# Altium project PCB Version 0.3.PrjPcb (part 1 of 2)
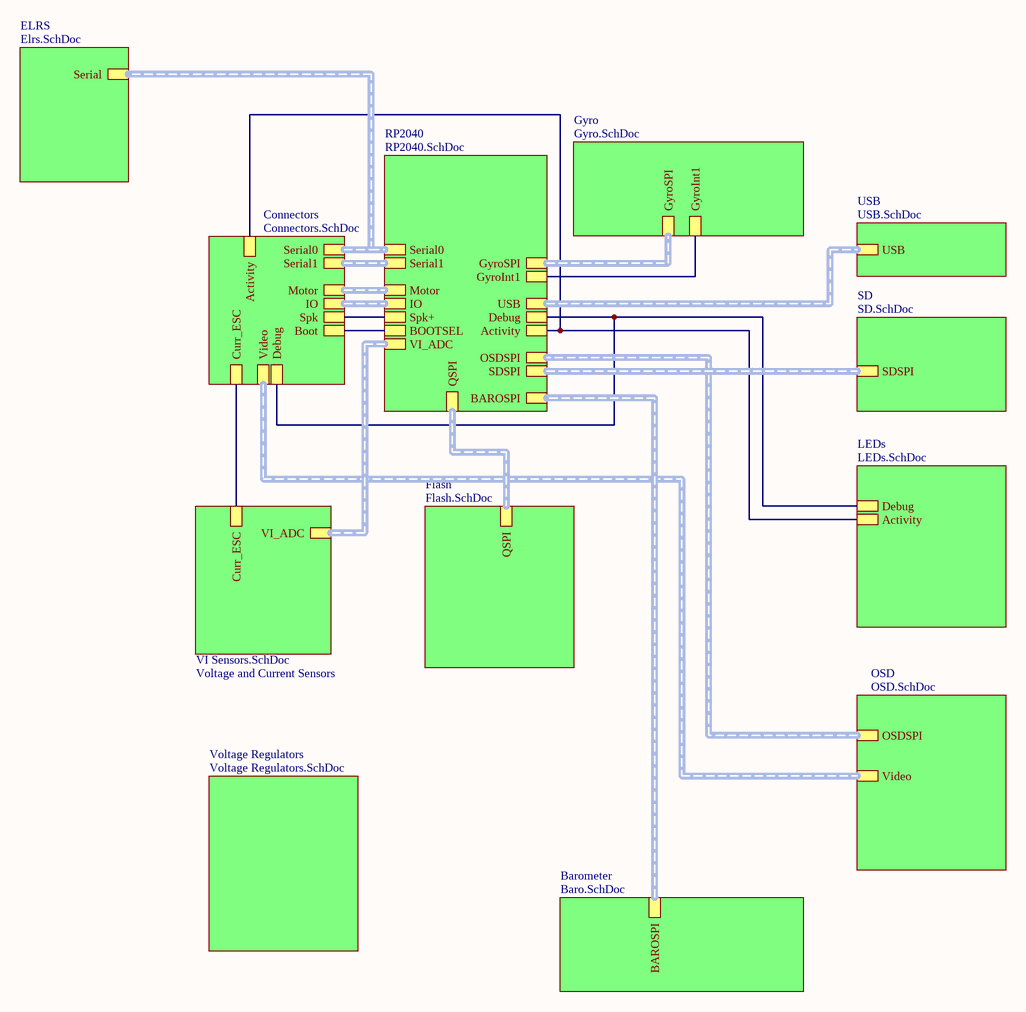
[diagram p0: Main.SchDoc]
12 sheets, 174 parts. Net scope: hierarchical (ports join the sheet entries above them; power ports are global).
Board file: PCB v0.3.PcbDoc
Sheets:
  Main.SchDoc
    RP2040 = RP2040.SchDoc
    Flash = Flash.SchDoc
    Voltage Regulators = Voltage Regulators.SchDoc
    USB = USB.SchDoc
    LEDs = LEDs.SchDoc
    OSD = OSD.SchDoc
    Barometer = Baro.SchDoc
    Gyro = Gyro.SchDoc
    Connectors = Connectors.SchDoc
    Voltage and Current Sensors = VI Sensors.SchDoc
    ELRS = ELRS.SchDoc

## Sheet Main.SchDoc
size A3; SheetNumber: 1; SheetTotal: 13

### Sub-sheets
Barometer = Baro.SchDoc: BAROSPI (harness SPI)
Connectors = Connectors.SchDoc: Serial1 (harness UART), Motor (harness Motor), Serial0 (harness UART), Curr_ESC, IO (harness IO), Video (harness Video), Spk, Debug, Activity, Boot
ELRS = Elrs.SchDoc: Serial (harness UART)
Flash = Flash.SchDoc: QSPI (harness QSPI)
Gyro = Gyro.SchDoc: GyroSPI (harness SPI), GyroInt1
LEDs = LEDs.SchDoc: Debug, Activity
OSD = OSD.SchDoc: OSDSPI (harness SPI), Video (harness Video)
RP2040 = RP2040.SchDoc: QSPI (harness QSPI), USB (harness USB), Debug, Activity, BAROSPI (harness SPI), OSDSPI (harness SPI), GyroSPI (harness SPI), GyroInt1, Serial1 (harness UART), Motor (harness Motor), Serial0 (harness UART), VI_ADC (harness VI), IO (harness IO), Spk+, BOOTSEL, SDSPI (harness SPI)
SD = SD.SchDoc (file not in this document): SDSPI (harness SPI)
USB = USB.SchDoc: USB (harness USB)
Voltage and Current Sensors = VI Sensors.SchDoc: Curr_ESC, VI_ADC (harness VI)
Voltage Regulators = Voltage Regulators.SchDoc: no entries

### Nets
Activity: sheet RP2040/Activity, sheet LEDs/Activity, sheet Connectors/Activity
Curr_ESC: sheet Connectors/Curr_ESC, sheet Voltage and Current Sensors/Curr_ESC
Debug: sheet RP2040/Debug, sheet LEDs/Debug, sheet Connectors/Debug
Gyro_Int1: sheet RP2040/GyroInt1, sheet Gyro/GyroInt1
Spk+: sheet RP2040/Spk+, sheet Connectors/Spk
NetIC1_56: sheet RP2040/BOOTSEL, sheet Connectors/Boot

### Buses and harness runs
harness sheet Barometer/BAROSPI = sheet RP2040/BAROSPI
harness sheet Connectors/IO = sheet RP2040/IO
harness sheet Connectors/Motor = sheet RP2040/Motor
harness sheet Connectors/Serial0 = sheet ELRS/Serial = sheet RP2040/Serial0
harness sheet Connectors/Serial1 = sheet RP2040/Serial1
harness sheet Connectors/Video = sheet OSD/Video
harness sheet Flash/QSPI = sheet RP2040/QSPI
harness sheet Gyro/GyroSPI = sheet RP2040/GyroSPI
harness sheet OSD/OSDSPI = sheet RP2040/OSDSPI
harness sheet RP2040/SDSPI = sheet SD/SDSPI
harness sheet RP2040/USB = sheet USB/USB
harness sheet RP2040/VI_ADC = sheet Voltage and Current Sensors/VI_ADC

## Sheet RP2040.SchDoc
size A3; SheetNumber: 9; SheetTotal: 13; SPICEModelCacheJQUAOKPN: <root> / <DocumentId>JQUAOKPN</DocumentId> / <CacheFrame Number="0"> / <Model Name="0402_885012205086_100nf" Kind="CKT"> / <Text>******* / .subckt 0402_885012205086_100nF 1 2 / Rser 1 3 0.07 / Lser 2 4 0.00000000055 / C1 3 4 0.0000001 / Rpar 3 4 1000000000 / .ends 0402_885012205086_100nF</Text> / </Model> / </CacheFrame> / </root>
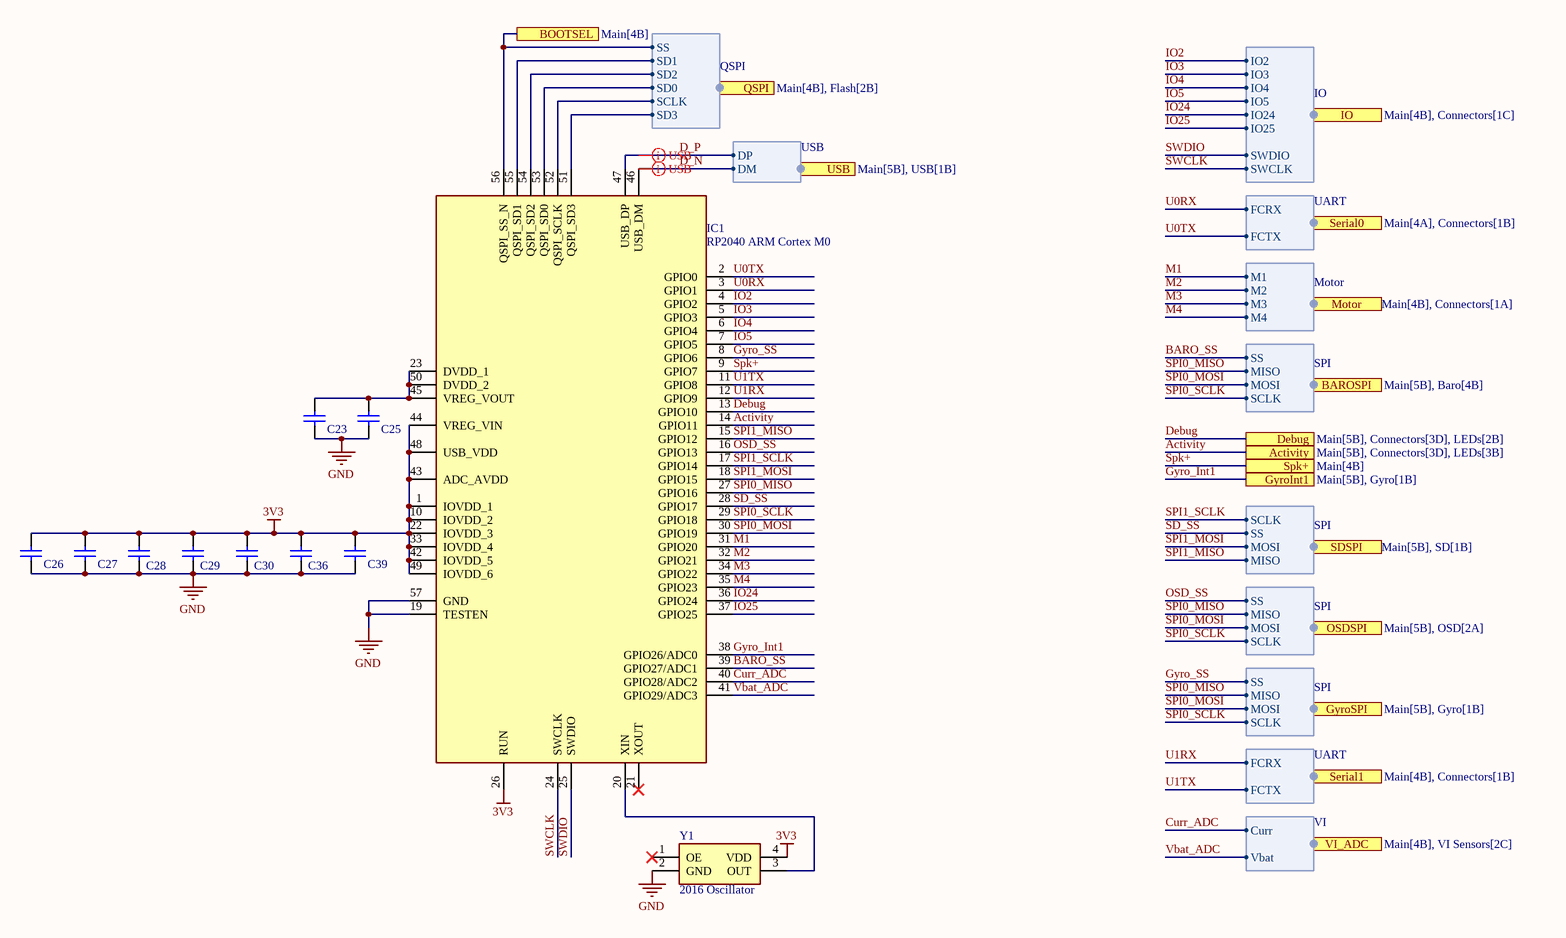
[diagram p1: RP2040.SchDoc]

### Parts
C23  100nF  [WCAP-CSGP_0402_L1W0.5H0.5]  (value not drawn)
C25  100nF  [WCAP-CSGP_0402_L1W0.5H0.5]  (value not drawn)
C26  100nF  [WCAP-CSGP_0402_L1W0.5H0.5]  (value not drawn)
C27  100nF  [WCAP-CSGP_0402_L1W0.5H0.5]  (value not drawn)
C28  100nF  [WCAP-CSGP_0603_L1.6W0.8H0.8_Reflow]  (value not drawn)
C29  100nF  [WCAP-CSGP_0603_L1.6W0.8H0.8_Reflow]  (value not drawn)
C30  100nF  [WCAP-CSGP_0603_L1.6W0.8H0.8_Reflow]  (value not drawn)
C36  100nF  [WCAP-CSGP_0603_L1.6W0.8H0.8_Reflow]  (value not drawn)
C39  100nF  [WCAP-CSGP_0402_L1W0.5H0.5]  (value not drawn)
IC1  RP2040 ARM Cortex M0  [SC091413]
Y1  2016 Oscillator  [2016 Oscillator]

### Ports
Activity (see Main[5B], Connectors[3D], LEDs[3B]), BAROSPI (harness SPI, see Main[5B], Baro[4B]), BOOTSEL (see Main[4B]), Debug (see Main[5B], Connectors[3D], LEDs[2B]), GyroInt1 (see Main[5B], Gyro[1B]), GyroSPI (harness SPI, see Main[5B], Gyro[1B]), IO (harness IO, see Main[4B], Connectors[1C]), Motor (harness Motor, see Main[4B], Connectors[1A]), OSDSPI (harness SPI, see Main[5B], OSD[2A]), QSPI (harness QSPI, see Main[4B], Flash[2B]), SDSPI (harness SPI, see Main[5B], SD[1B]), Serial0 (harness UART, see Main[4A], Connectors[1B]), Serial1 (harness UART, see Main[4B], Connectors[1B]), Spk+ (see Main[4B]), USB (harness USB, see Main[5B], USB[1B]), VI_ADC (harness VI, see Main[4B], VI Sensors[2C])

### Harnesses
QSPI: SS, SD1, SD2, SD0, SCLK, SD3
USB: DP, DM
SPI: SS, MISO, MOSI, SCLK
UART: FCRX, FCTX
Motor: M2, M4, M1, M3
VI: Curr, Vbat
IO: IO24, IO25, SWDIO, SWCLK, IO4, IO5, IO3, IO2
SPI: MISO, MOSI, SS, SCLK

### Nets
3V3: C26.2 C27.2 C28.2 C29.2 C30.2 C36.2 C39.2 IC1.1(IOVDD_1) IC1.10(IOVDD_2) IC1.22(IOVDD_3) IC1.26(RUN) IC1.33(IOVDD_4) IC1.42(IOVDD_5) IC1.43(ADC_AVDD) IC1.44(VREG_VIN) IC1.48(USB_VDD) IC1.49(IOVDD_6) Y1.4(VDD)
GND: C23.1 C25.1 C26.1 C27.1 C28.1 C29.1 C30.1 C36.1 C39.1 IC1.19(TESTEN) IC1.57(GND) Y1.2(GND)
Activity: IC1.14(GPIO11) ; port Activity
BARO_SS: IC1.39(GPIO27/ADC1) ; port BAROSPI.SS
Curr_ADC: IC1.40(GPIO28/ADC2) ; port VI_ADC.Curr
D_N: IC1.46(USB_DM) ; port USB.DM
D_P: IC1.47(USB_DP) ; port USB.DP
Debug: IC1.13(GPIO10) ; port Debug
Gyro_Int1: IC1.38(GPIO26/ADC0) ; port GyroInt1
Gyro_SS: IC1.8(GPIO6) ; port GyroSPI.SS  [project net CSB]
IO2: IC1.4(GPIO2) ; port IO.IO2
IO3: IC1.5(GPIO3) ; port IO.IO3
IO4: IC1.6(GPIO4) ; port IO.IO4
IO5: IC1.7(GPIO5) ; port IO.IO5
IO24: IC1.36(GPIO24) ; port IO.IO24
IO25: IC1.37(GPIO25) ; port IO.IO25
M1: IC1.31(GPIO20) ; port Motor.M1
M2: IC1.32(GPIO21) ; port Motor.M2
M3: IC1.34(GPIO22) ; port Motor.M3
M4: IC1.35(GPIO23) ; port Motor.M4
OSD_SS: IC1.16(GPIO13) ; port OSDSPI.SS
SD_SS: IC1.28(GPIO17) ; port SDSPI.SS
SPI0_MISO: IC1.27(GPIO16) ; port BAROSPI.MISO, port OSDSPI.MISO, port GyroSPI.MISO  [project net MISO]
SPI0_MOSI: IC1.30(GPIO19) ; port BAROSPI.MOSI, port OSDSPI.MOSI, port GyroSPI.MOSI  [project net MOSI]
SPI0_SCLK: IC1.29(GPIO18) ; port BAROSPI.SCLK, port OSDSPI.SCLK, port GyroSPI.SCLK  [project net SCLK]
SPI1_MISO: IC1.15(GPIO12) ; port SDSPI.MISO
SPI1_MOSI: IC1.18(GPIO15) ; port SDSPI.MOSI
SPI1_SCLK: IC1.17(GPIO14) ; port SDSPI.SCLK
Spk+: IC1.9(GPIO7) ; port Spk+
SWCLK: IC1.24(SWCLK) ; port IO.SWCLK
SWDIO: IC1.25(SWDIO) ; port IO.SWDIO
U0RX: IC1.3(GPIO1) ; port Serial0.FCRX  [project net ESPTX]
U0TX: IC1.2(GPIO0) ; port Serial0.FCTX  [project net ESPRX]
U1RX: IC1.12(GPIO9) ; port Serial1.FCRX
U1TX: IC1.11(GPIO8) ; port Serial1.FCTX
Vbat_ADC: IC1.41(GPIO29/ADC3) ; port VI_ADC.Vbat
NetC23_2: C23.2 C25.2 IC1.23(DVDD_1) IC1.45(VREG_VOUT) IC1.50(DVDD_2)
NetIC1_20: IC1.20(XIN) Y1.3(OUT)
NetIC1_51: IC1.51(QSPI_SD3) ; port QSPI.SD3
NetIC1_52: IC1.52(QSPI_SCLK) ; port QSPI.SCLK
NetIC1_53: IC1.53(QSPI_SD0) ; port QSPI.SD0
NetIC1_54: IC1.54(QSPI_SD2) ; port QSPI.SD2
NetIC1_55: IC1.55(QSPI_SD1) ; port QSPI.SD1
NetIC1_56: IC1.56(QSPI_SS_N) ; port BOOTSEL, port QSPI.SS

Not connected (* = marked no-connect by the designer): IC1 21(XOUT)*; Y1 1(OE)*

### Layout directives
differential pair: D_N, D_P

### Library data of the parts
C23 C25-C27 C39 = 885012205086: WCAP-CSGP Multilayer Ceramic Chip Capacitor, General Purpose, size 0402, X7R, 100nF, 50VDC; Manufacturer: Wurth Elektronik; Case/Size Code: 0402; Capacitance Tolerance: +/-10%; Dissipation Factor: 10%; Insulation Resistance: 0.5GΩ; Rated Voltage (DC): 50V; Technical Reference: X7R0402104K050DFCT10000; Manufacturer Part Number: 885012205086; Category: Multilayer Ceramic Chip Capacitors; Match Code: WCAP-CSGP; ComponentLink1Description: Website Link; ComponentLink1URL: https://www.we-online.com/redexpert/article/885012205086?ad; ComponentLink2Description: Datasheet Link; ComponentLink2URL: https://www.we-online.com/redexpert/spec/885012205086?ad; Mount: Surface Mount; Operating Temperature Max: 125°C; Operating Temperature Min: -55°C; Packaging: Tape and Reel; Length: 1mm; Width: 0.5mm; Height: 0.5mm; Capacitance: 100nF; Ceramic Type: X7R
C28-C30 C36 = 885012206095: WCAP-CSGP Multilayer Ceramic Chip Capacitor, General Purpose, size 0603, X7R, 100nF, 50VDC; Manufacturer: Wurth Elektronik; Case/Size Code: 0603; Capacitance Tolerance: +/-10%; Dissipation Factor: 3%; Insulation Resistance: 5GΩ; Rated Voltage (DC): 50V; Technical Reference: X7R0603104K050DFCT10000; Manufacturer Part Number: 885012206095; Category: Multilayer Ceramic Chip Capacitors; Match Code: WCAP-CSGP; ComponentLink1Description: Website Link; ComponentLink1URL: https://www.we-online.com/redexpert/article/885012206095?ad; ComponentLink2Description: Datasheet Link; ComponentLink2URL: https://www.we-online.com/redexpert/spec/885012206095?ad; Mount: Surface Mount; Operating Temperature Max: 125°C; Operating Temperature Min: -55°C; Packaging: Tape and Reel; Length: 1.6mm; Width: 0.8mm; Height: 0.8mm; Capacitance: 100nF; Ceramic Type: X7R
IC1 = RP2040: Microcontroller; Manufacturer_Name: RASPBERRY-PI; Manufacturer_Part_Number: SC0914(13); Datasheet Link: https://datasheets.raspberrypi.com/rp2040/rp2040-datasheet.pdf; Height: 0.9mm; Mouser Part Number: 358-SC091413; Mouser Price/Stock: https://www.mouser.co.uk/ProductDetail/Raspberry-Pi/SC091413?qs=T%252BzbugeAwjhr%252BUbBr3TJcw%3D%3D
Y1 = 2016 Oscillator: YXC OT201612MJBA4SL; Manufacturer_Name: Microchip; Manufacturer_Part_Number: DSC6003MA3B-032K768; Datasheet Link: https://www.mouser.es/datasheet/2/268/DSC60xxB-Ultra-Small-Ultra-Low-Power-MEMS-Oscillat-1660527.pdf; Height: 0.89mm; Mouser Part Number: 579-6003MA3B032K768; Mouser Price/Stock: https://www.mouser.co.uk/ProductDetail/Microchip-Technology/DSC6003MA3B-032K768?qs=PqoDHHvF64%252BWTEYTiC%2Fvdw%3D%3D

## Sheet Flash.SchDoc
size A4; SheetNumber: 5; SheetTotal: 13
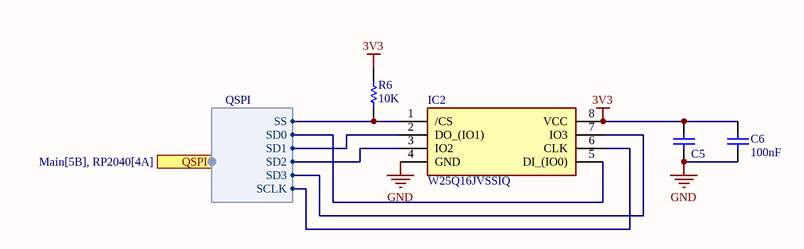
[diagram p2: Flash.SchDoc]

### Parts
C5  100nF  [WCAP-CSGP_0603_L1.6W0.8H0.8_Reflow]  (value not drawn)
C6  100nF  [0402 cap]
IC2  W25Q16JVSSIQ  [SOIC127P790X216-8N]
R6  10K  [RESC0603(1608)_N]

### Ports
QSPI (harness QSPI, see Main[5B], RP2040[4A])

### Harnesses
QSPI: SS, SD0, SD1, SD2, SD3, SCLK

### Nets
3V3: C5.2 C6.2 IC2.8(VCC) R6.2
GND: C5.1 C6.1 IC2.4(GND)
NetIC1_51: IC2.7(IO3) ; port QSPI.SD3
NetIC1_52: IC2.6(CLK) ; port QSPI.SCLK
NetIC1_53: IC2.5(DI_(IO0)) ; port QSPI.SD0
NetIC1_54: IC2.3(IO2) ; port QSPI.SD2
NetIC1_55: IC2.2(DO_(IO1)) ; port QSPI.SD1
NetIC1_56: IC2.1(/CS) R6.1 ; port QSPI.SS

### Library data of the parts
C5 = 885012206095: as C28 on sheet RP2040; Manufacturer Part Number: 885012206095; Category: Multilayer Ceramic Chip Capacitors; Match Code: WCAP-CSGP; ComponentLink1Description: Website Link; ComponentLink1URL: https://www.we-online.com/redexpert/article/885012206095?ad; ComponentLink2Description: Datasheet Link; ComponentLink2URL: https://www.we-online.com/redexpert/spec/885012206095?ad; Mount: Surface Mount; Operating Temperature Max: 125°C; Operating Temperature Min: -55°C; Packaging: Tape and Reel; Length: 1.6mm; Width: 0.8mm; Height: 0.8mm; Capacitance: 100nF; Ceramic Type: X7R
C6 = Capacitor 0402 100nF: Value: 100nF
IC2 = W25Q16JVSSIQ: Integrated Circuit; Manufacturer_Name: Winbond; Datasheet Link: https://www.winbond.com/hq/search-resource-file.jsp?partNo=W25Q16JVSSIQ&type=datasheet; Height: 2.16mm; Manufacturer_Part_Number: W25Q16JVSSIQ; Mouser Part Number: 454-W25Q16JVSSIQ; Mouser Price/Stock: https://www.mouser.co.uk/ProductDetail/Winbond/W25Q16JVSSIQ?qs=qSfuJ%252Bfl%2Fd46L%2F1QrQC%2Fog%3D%3D; Arrow Part Number: W25Q16JVSSIQ; Arrow Price/Stock: https://www.arrow.com/en/products/w25q16jvssiq/winbond-electronics?region=nac
R6 = Res 10K: Chipwiderstand, SMD, Baureihe MC, 1%; Manufacturer: Multicomp; PackageReference: 0603; Value: 10K; OC_FARNELL: 9330399

## Sheet Voltage Regulators.SchDoc
size A4; SheetNumber: 13; SheetTotal: 13; SPICEModelCacheFXTNRSHI: <root> / <DocumentId>FXTNRSHI</DocumentId> / <CacheFrame Number="0"> / <Model Name="1206_885012108012_47uf" Kind="CKT"> / <Text>******* / .subckt 1206_885012108012_47uF 1 2 / Rser 1 3 0.0027428064885 / Lser 2 4 0.0000000008 / C1 3 4 0.000047 / Rpar 3 4 1000000 / .ends 1206_885012108012_47uF</Text> / </Model> / <Model Name="1210_885012209074_22uf" Kind="CKT"> / <Text>******* / .subckt 1210_885012209074_22uF 1 2 / Rser 1 3 0.0043 / Lser 2 4 0.000000001 / C1 3 4 0.000022 / Rpar 3 4 5000000 / .ends 1210_885012209074_22uF</Text> / </Model> / </CacheFrame> / </root>
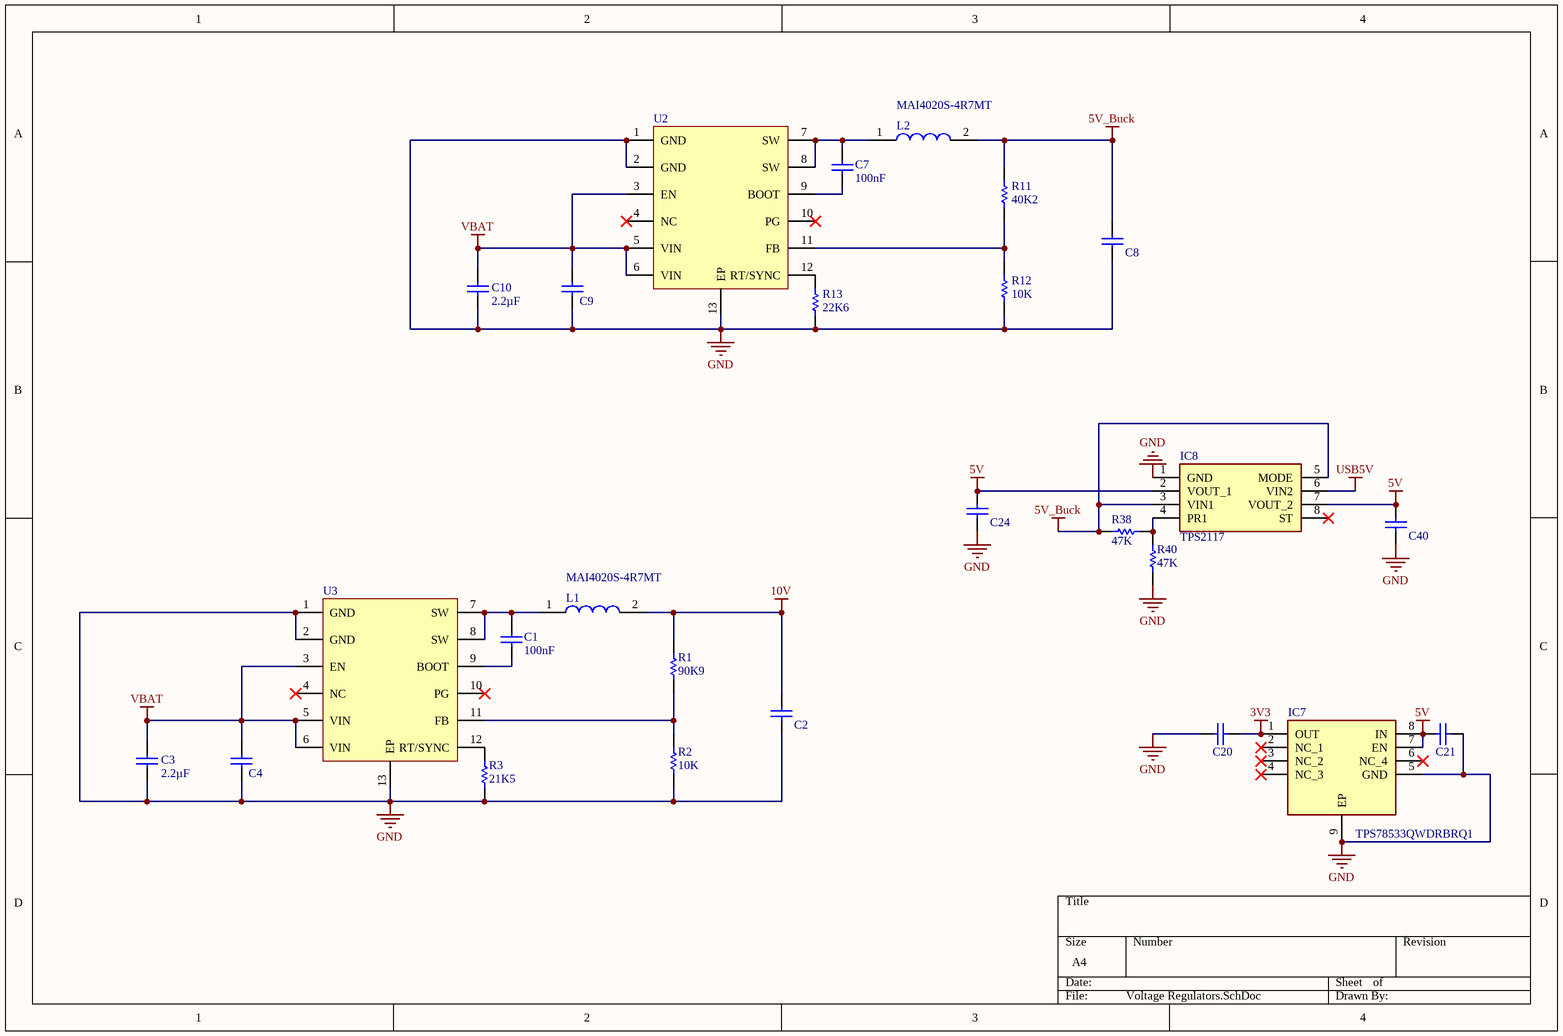
[diagram p3: Voltage Regulators.SchDoc]

### Parts
C1  100nF  [0402 cap]
C2  22µF  [WCAP-CSGP_1210_L3.2W2.5H2.5]  (value not drawn)
C3  2.2µF  [WCAP-CSGP_1206_L3.2W1.6H1.6]
C4  100nF  [WCAP-CSGP_0603_L1.6W0.8H0.8_Reflow]  (value not drawn)
C7  100nF  [0402 cap]
C8  47µF  [WCAP-CSGP_1206_L3.2W1.6H1.6]  (value not drawn)
C9  100nF  [WCAP-CSGP_0603_L1.6W0.8H0.8_Reflow]  (value not drawn)
C10  2.2µF  [WCAP-CSGP_1206_L3.2W1.6H1.6]
C20  1µF  [WCAP-CSGP_0603_L1.6W0.8H0.8_Reflow]  (value not drawn)
C21  1µF  [WCAP-CSGP_0603_L1.6W0.8H0.8_Reflow]  (value not drawn)
C24  1µF  [WCAP-CSGP_0603_L1.6W0.8H0.8_Reflow]  (value not drawn)
C40  1µF  [WCAP-CSGP_0603_L1.6W0.8H0.8_Reflow]  (value not drawn)
IC7  TPS78533QWDRBRQ1  [SON65P300X300X100-9N-D]
IC8  TPS2117  [SOTFL50P160X60-8N]
L1  MAI4020S-4R7MT  [MAI4020S-4R7MT]
L2  MAI4020S-4R7MT  [MAI4020S-4R7MT]
R1  90K9  [0402 resistor]
R2  10K  [0402 resistor]
R3  21K5  [0402 resistor]
R11  40K2  [RESC0603(1608)_N]
R12  10K  [RESC0603(1608)_N]
R13  22K6  [RESC0603(1608)_N]
R38  47K  [0402 resistor]
R40  47K  [0402 resistor]
U2  2.5A Step Down QFN synchronous  [LMR38025]  (value not drawn)
U3  2.5A Step Down QFN synchronous  [LMR38025]  (value not drawn)

### Nets
3V3: C20.2 IC7.1(OUT)
5V: C21.1 C24.2 C40.2 IC7.7(EN) IC7.8(IN) IC8.2(VOUT_1) IC8.7(VOUT_2)
5V_Buck: C8.2 IC8.3(VIN1) IC8.5(MODE) L2.2 R11.2 R38.1
10V: C2.2 L1.2 R1.2
GND: C2.1 C3.1 C4.1 C8.1 C9.1 C10.1 C20.1 C21.2 C24.1 C40.1 IC7.5(GND) IC7.9(EP) IC8.1(GND) R2.1 R3.1 R12.1 R13.1 R40.1 U2.1(GND) U2.2(GND) U2.13(EP) U3.1(GND) U3.2(GND) U3.13(EP)
USB5V: IC8.6(VIN2)
VBAT: C3.2 C4.2 C9.2 C10.2 U2.3(EN) U2.5(VIN) U2.6(VIN) U3.3(EN) U3.5(VIN) U3.6(VIN)
NetC1_1: C1.1 U3.9(BOOT)
NetC1_2: C1.2 L1.1 U3.7(SW) U3.8(SW)
NetC7_1: C7.1 U2.9(BOOT)
NetC7_2: C7.2 L2.1 U2.7(SW) U2.8(SW)
NetIC8_4: IC8.4(PR1) R38.2 R40.2
NetR1_1: R1.1 R2.2 U3.11(FB)
NetR3_2: R3.2 U3.12(RT/SYNC)
NetR11_1: R11.1 R12.2 U2.11(FB)
NetR13_2: R13.2 U2.12(RT/SYNC)

Not connected (* = marked no-connect by the designer): IC7 2(NC_1)* 3(NC_2)* 4(NC_3)* 6(NC_4)*; IC8 8(ST)*; U2 4(NC)* 10(PG)*; U3 4(NC)* 10(PG)*

### Library data of the parts
C1 C7 = Capacitor 0402 100nF: Value: 100nF
C2 = 885012209074: WCAP-CSGP Multilayer Ceramic Chip Capacitor, General Purpose, size 1210, X7R, 22µF, 25VDC; Manufacturer: Wurth Elektronik; Case/Size Code: 1210; Capacitance Tolerance: +/10%; Dissipation Factor: 10%; Insulation Resistance: 0.005GΩ; Rated Voltage (DC): 25V; Technical Reference: X7R1210226K025DFCT10000; Manufacturer Part Number: 885012209074; Category: Multilayer Ceramic Chip Capacitors; Match Code: WCAP-CSGP; ComponentLink1Description: Website Link; ComponentLink1URL: https://www.we-online.com/redexpert/article/885012209074?ad; ComponentLink2Description: Datasheet Link; ComponentLink2URL: https://www.we-online.com/redexpert/spec/885012209074?ad; Mount: Surface Mount; Operating Temperature Max: 125°C; Operating Temperature Min: -55°C; Packaging: Tape and Reel; Length: 3.2mm; Width: 2.5mm; Height: 2.5mm; Capacitance: 22µF; Ceramic Type: X7R
C3 C10 = 885012208124: WCAP-CSGP Multilayer Ceramic Chip Capacitor, General Purpose, size 1206, X7R, 2.2µF, 100VDC; Manufacturer: Wurth Elektronik; Case/Size Code: 1206; Capacitance Tolerance: +/-10%; Dissipation Factor: 5%; Insulation Resistance: 0.05GΩ; Rated Voltage (DC): 100V; Technical Reference: X7R1206225K100DFCT10000; Manufacturer Part Number: 885012208124; Category: Multilayer Ceramic Chip Capacitors; Match Code: WCAP-CSGP; ComponentLink1Description: Website Link; ComponentLink1URL: https://www.we-online.com/redexpert/article/885012208124?ad; ComponentLink2Description: Datasheet Link; ComponentLink2URL: https://www.we-online.com/redexpert/spec/885012208124?ad; Mount: Surface Mount; Operating Temperature Max: 125°C; Operating Temperature Min: -55°C; Packaging: Tape and Reel; Length: 3.2mm; Width: 1.6mm; Height: 1.6mm; Capacitance: 2.2µF; Ceramic Type: X7R
C4 C9 = 885012206095: as C28 on sheet RP2040; Manufacturer Part Number: 885012206095; Category: Multilayer Ceramic Chip Capacitors; Match Code: WCAP-CSGP; ComponentLink1Description: Website Link; ComponentLink1URL: https://www.we-online.com/redexpert/article/885012206095?ad; ComponentLink2Description: Datasheet Link; ComponentLink2URL: https://www.we-online.com/redexpert/spec/885012206095?ad; Mount: Surface Mount; Operating Temperature Max: 125°C; Operating Temperature Min: -55°C; Packaging: Tape and Reel; Length: 1.6mm; Width: 0.8mm; Height: 0.8mm; Capacitance: 100nF; Ceramic Type: X7R
C8 = 885012108012: WCAP-CSGP Multilayer Ceramic Chip Capacitor, General Purpose, size 1206, X5R, 47µF, 10VDC; Manufacturer: Wurth Elektronik; Case/Size Code: 1206; Capacitance Tolerance: +/-20%; Dissipation Factor: 10%; Insulation Resistance: 0.002GΩ; Rated Voltage (DC): 10V; Technical Reference: X5R1206476M010DFCT10000; Manufacturer Part Number: 885012108012; Category: Multilayer Ceramic Chip Capacitors; Match Code: WCAP-CSGP; ComponentLink1Description: Website Link; ComponentLink1URL: https://www.we-online.com/redexpert/article/885012108012?ad; ComponentLink2Description: Datasheet Link; ComponentLink2URL: https://www.we-online.com/redexpert/spec/885012108012?ad; Mount: Surface Mount; Operating Temperature Max: 85°C; Operating Temperature Min: -55°C; Packaging: Tape and Reel; Length: 3.2mm; Width: 1.6mm; Height: 1.6mm; Capacitance: 47µF; Ceramic Type: X5R
C20 C21 = 885012206026: WCAP-CSGP Multilayer Ceramic Chip Capacitor, General Purpose, size 0603, X7R, 1µF, 10VDC; Manufacturer: Wurth Elektronik; Case/Size Code: 0603; Capacitance Tolerance: +/-10%; Dissipation Factor: 10%; Insulation Resistance: 0.1GΩ; Rated Voltage (DC): 10V; Technical Reference: X7R0603105K010DFCT10000; ComponentLink1Description: Website Link; ComponentLink1URL: https://www.we-online.com/redexpert/article/885012206026?ad; ComponentLink2Description: Datasheet Link; ComponentLink2URL: https://www.we-online.com/redexpert/spec/885012206026?ad; Manufacturer Part Number: 885012206026; Category: Multilayer Ceramic Chip Capacitors; Match Code: WCAP-CSGP; Mount: Surface Mount; Operating Temperature Max: 125°C; Operating Temperature Min: -55°C; Packaging: Tape and Reel; Length: 1.6mm; Width: 0.8mm; Height: 0.8mm; Capacitance: 1µF; Ceramic Type: X7R
C24 C40 = 885012106017: WCAP-CSGP Multilayer Ceramic Chip Capacitor, General Purpose, size 0603, X5R, 1µF, 16VDC; Manufacturer: Wurth Elektronik; Case/Size Code: 0603; Capacitance Tolerance: +/-20%; Dissipation Factor: 10%; Insulation Resistance: 0.1GΩ; Rated Voltage (DC): 16V; Technical Reference: X5R0603105M016DFCT10000; ComponentLink1Description: Website Link; ComponentLink1URL: https://www.we-online.com/redexpert/article/885012106017?ad; ComponentLink2Description: Datasheet Link; ComponentLink2URL: https://www.we-online.com/redexpert/spec/885012106017?ad; Manufacturer Part Number: 885012106017; Category: Multilayer Ceramic Chip Capacitors; Match Code: WCAP-CSGP; Mount: Surface Mount; Operating Temperature Max: 85°C; Operating Temperature Min: -55°C; Packaging: Tape and Reel; Length: 1.6mm; Width: 0.8mm; Height: 0.8mm; Capacitance: 1µF; Ceramic Type: X5R
IC7 = TPS78533QWDRBRQ1: Integrated Circuit; Manufacturer_Name: Texas Instruments; Datasheet Link: https://www.arrow.com/en/products/tps78533qwdrbrq1/texas-instruments?region=nac; Height: 1mm; Manufacturer_Part_Number: TPS78533QWDRBRQ1; Mouser Part Number: 595-TPS78533QWDRBRQ1; Mouser Price/Stock: https://www.mouser.co.uk/ProductDetail/Texas-Instruments/TPS78533QWDRBRQ1?qs=iLbezkQI%252BsiNbdqh2Ko9GQ%3D%3D; Arrow Part Number: TPS78533QWDRBRQ1; Arrow Price/Stock: https://www.arrow.com/en/products/tps78533qwdrbrq1/texas-instruments?region=nac
IC8 = TPS2116DRLR: Integrated Circuit; Manufacturer_Name: Texas Instruments; Datasheet Link: https://www.ti.com/lit/gpn/tps2116; Height: 0.6mm; Manufacturer_Part_Number: TPS2116DRLR; Mouser Part Number: 595-TPS2116DRLR; Mouser Price/Stock: https://www.mouser.co.uk/ProductDetail/Texas-Instruments/TPS2116DRLR?qs=aP1CjGhiNiGo3XAyXcVPaQ%3D%3D; Arrow Part Number: TPS2116DRLR; Arrow Price/Stock: https://www.arrow.com/en/products/tps2116drlr/texas-instruments?region=nac
R1-R3 R38 R40 = Resistor 0402 1K
  R1: Value: 90K9
  R2: Value: 10K
  R3: Value: 21K5
  R38 R40: Value: 47K
R11-R13 = Res 33K: Chipwiderstand, SMD, Baureihe MC, 1%; Manufacturer: Multicomp; PackageReference: 0603; OC_FARNELL: 9331506
  R11: Value: 40K2
  R12: Value: 10K
  R13: Value: 22K6
U2 U3 = LMR38025: LMR38025-Q1 SIMPLE SWITCHER® Power Converter, 4.2-V to 80-V, 2.5-A Automotive / Synchronous Buck Converter With 40-μA IQ

## Sheet USB.SchDoc
size A4; SheetNumber: 10; SheetTotal: 11
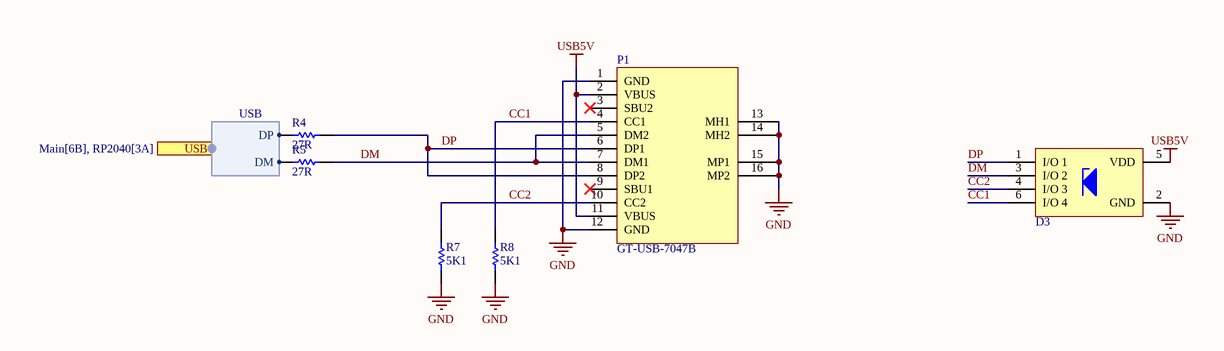
[diagram p4: USB.SchDoc]

### Parts
D3  3.3V  [WE-TVS_SOT23-6L]  (value not drawn)
P1  GT-USB-7047B  [GT-USB-7047B]
R4  27R  [RESC0603(1608)_N]
R5  27R  [RESC0603(1608)_N]
R7  5K1  [RESC0603(1608)_N]
R8  5K1  [RESC0603(1608)_N]

### Ports
USB (harness USB, see Main[6B], RP2040[3A])

### Harnesses
USB: DP, DM

### Nets
GND: D3.2(GND) P1.1(GND) P1.12(GND) P1.13(MH1) P1.14(MH2) P1.15(MP1) P1.16(MP2) R7.1 R8.1
USB5V: D3.5(VDD) P1.2(VBUS) P1.11(VBUS)
CC1: D3.6(I/O_4) P1.4(CC1) R8.2
CC2: D3.4(I/O_3) P1.10(CC2) R7.2
D_N: R5.1 ; port USB.DM
D_P: R4.1 ; port USB.DP
DM: D3.3(I/O_2) P1.5(DM2) P1.7(DM1) R5.2
DP: D3.1(I/O_1) P1.6(DP1) P1.8(DP2) R4.2

Not connected (* = marked no-connect by the designer): P1 3(SBU2)* 9(SBU1)*

### Library data of the parts
D3 = 824015043: WE-TVS TVS Diode – High Speed Series, SOT23-6L, 4+1 Channel, 3.3V, 2pF; Manufacturer: Wurth Elektronik; Channel ESD Clamping Voltage: 7.5V; Channel Reverse Leakage Current: 1µA; ESD Air Discharge Capability: 30kV; Polarity: Unidirectional; (Reverse) Breakdown Voltage: 4.5V; (Reverse) Peak Pulse Current: 30A; ComponentLink1Description: Website Link; ComponentLink1URL: https://www.we-online.com/redexpert/article/824015043?ad; ComponentLink2Description: Datasheet Link; ComponentLink2URL: https://www.we-online.com/redexpert/spec/824015043?ad; Manufacturer Part Number: 824015043; Category: ESD Protection; Match Code: WE-TVS; Mount: Surface Mount; Operating Temperature Max: 125°C; Operating Temperature Min: -55°C; Packaging: Tape and Reel; Case/Size Code: SOT23-6L; Length: 2.9mm; Width: 2.8mm; Height: 1.45mm; Channel Input Capacitance: 2pF; Channel Operating Voltage: 3.3V; ESD Contact Discharge Capability: 30kV; Number of Channels: 4+1
R4 R5 = Res 27R: Chipwiderstand, Oberflächenmontage, Dickschicht, 27 ohm, 50 V, 0603 [Metrisch 1608], 100 mW, ± 1%; Manufacturer: Multicomp; PackageReference: 0603; Value: 27R; OC_FARNELL: 2447316
R7 R8 = Res 5K6: Chipwiderstand, SMD, Baureihe MC, 5%; Manufacturer: Multicomp; Value: 5K6; PackageReference: 0603; OC_FARNELL: 9332219

## Sheet LEDs.SchDoc
size A4; SheetNumber: 3; SheetTotal: 11; SPICEModelCachePAYDFKMG: <root> / <DocumentId>PAYDFKMG</DocumentId> / <CacheFrame Number="0"> / <Model Name="0603_150060bs75000" Kind="CKT"> / <Text>****** / .subckt 0603_150060BS75000  1  2 / D1 1 2 SMCW / .MODEL SMCW D / + IS=316.72E-15 / + N=3.9746 / + RS=1.2476 / + IKF=130.15E-6 / + CJO=1.0000E-12 / + M=.3333 / + VJ=.75 / + BV=5 / + IBV=10.00E-6 / + TT=5.0000E-9 / .ends</Text> / </Model> / <Model Name="0603_150060ys75000" Kind="CKT"> / <Text>****** / .subckt 0603_150060YS75000  1  2 / D1 1 2 SMCW / .MODEL SMCW D / + IS=10.010E-21 / + N=1.8441 / + RS=1.0000E-6 / + IKF=1.0000E3 / + CJO=1.0000E-12 / + M=.3333 / + VJ=.75 / + BV=5 / + IBV=10.00E-6 / + TT=5.0000E-9 / .ends</Text> / </Model> / <Model Name="0603_150060as75000" Kind="CKT"> / <Text>************************************************** / * Manufacturer:           Wurth Elektronik / * Kinds:                  SMT Mono-color Chip LED Waterclear / * Matchcode:              WL-SMCW / * Library Type:           LTspice / * Version:                rev22a / * Created/modified by:    Ella / * Date and Time:          2022-02-18 / * Team:                   eiSos EDA Service / * Contact:                libraries@we-online.com / ************************************************** / * Copyright(C) 2022 WÃ¼rth Elektronik eiSos GmbH &amp; Co. KG / * All Rights Reserved. / ************************************************** / * Disclaimer: While WÃ¼rth Elektronik eiSos has made every reasonable effort to ensure the accuracy / * of the simulation models provided, WÃ¼rth Elektronik eiSos does not guarantee the exemption of error on / * the simulation models, nor does WÃ¼rth Elektronik eiSos guarantee that the simulation model is current. / * WÃ¼rth Elektronik eiSos reserves the right to make any adjustments at any time without notice. / * WÃ¼rth Elektronik eiSos expressly disclaims all implied warranties regarding this simulation model. / ************************************************** / .subckt 0603_150060AS75000  1  2 / D1 1 2 SMCW / .MODEL SMCW D / + IS=10.010E-21 / + N=1.8643 / + RS=1.0000E-6 / + IKF=999 / + CJO=1.0000E-12 / + M=.3333 / + VJ=.75 / + BV=100 / + TT=5.0000E-9 / .ends</Text> / </Model> / <Model Name="0603_150060rs75000" Kind="CKT"> / <Text>****** / .subckt 0603_150060RS75000  1  2 / D1 1 2 SMCW / .MODEL SMCW D / + IS=39.260E-18 / + N=2.2264 / + RS=1.0000E-6 / + IKF=.13281 / + CJO=1.0000E-12 / + M=.3333 / + VJ=.75 / + BV=100 / + IBV=10.00E-6 / + TT=5.0000E-9 / .ends</Text> / </Model> / </CacheFrame> / </root>
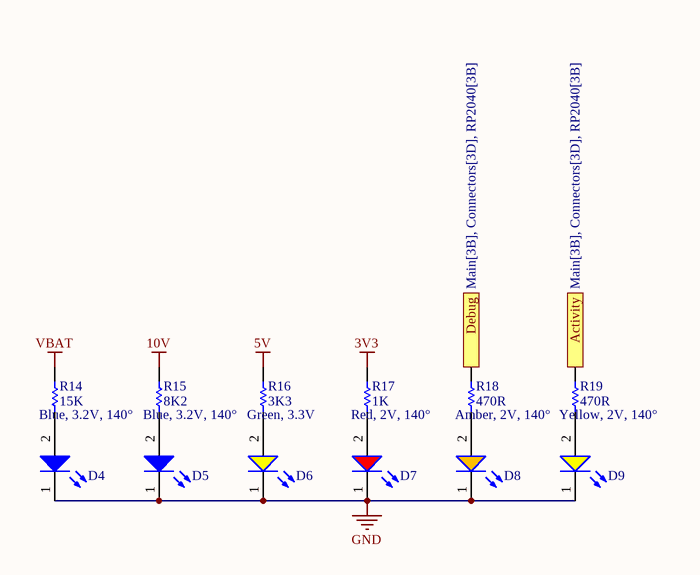
[diagram p5: LEDs.SchDoc]

### Parts
D4  Blue, 3.2V, 140°  [WL-SMCW_0603_150060xx75000]
D5  Blue, 3.2V, 140°  [WL-SMCW_0603_150060xx75000]
D6  Green, 3.3V  [WL-SMCW_0603_150060xx75000]
D7  Red, 2V, 140°  [WL-SMCW_0603_150060xx75000]
D8  Amber, 2V, 140°  [WL-SMCW_0603_150060xx75000]
D9  Yellow, 2V, 140°  [WL-SMCW_0603_150060xx75000]
R14  15K  [0402 resistor]
R15  8K2  [0402 resistor]
R16  3K3  [0402 resistor]
R17  1K  [0402 resistor]
R18  470R  [0402 resistor]
R19  470R  [0402 resistor]

### Ports
Activity (see Main[3B], Connectors[3D], RP2040[3B]), Debug (see Main[3B], Connectors[3D], RP2040[3B])

### Nets
3V3: R17.2
5V: R16.2
10V: R15.2
GND: D4.1(K) D5.1(K) D6.1(K) D7.1(K) D8.1(K) D9.1(K)
VBAT: R14.2
Activity: R19.2 ; port Activity
Debug: R18.2 ; port Debug
NetD4_2: D4.2(A) R14.1
NetD5_2: D5.2(A) R15.1
NetD6_2: D6.2(A) R16.1
NetD7_2: D7.2(A) R17.1
NetD8_2: D8.2(A) R18.1
NetD9_2: D9.2(A) R19.1

### Library data of the parts
D4 D5 = 150060BS75000: WL-SMCW Mono-color Chip LED Waterclear, size 0603, Blue, 3.2V, 140°; Manufacturer: Wurth Elektronik; Case/Size Code: 0603; Chip Technology: InGaN; Dominant Wavelength: 470nm; Luminous Intensity: 145mcd; Peak Wavelength: 465nm; Manufacturer Part Number: 150060BS75000; Category: Signal LEDs; Match Code: WL-SMCW; ComponentLink1Description: Website Link; ComponentLink1URL: https://www.we-online.com/redexpert/article/150060BS75000?ad; ComponentLink2Description: Datasheet Link; ComponentLink2URL: https://www.we-online.com/redexpert/spec/150060BS75000?ad; Mount: Surface Mount; Operating Temperature Max: 85°C; Operating Temperature Min: -40°C; Packaging: Tape and Reel; Length: 1.6mm; Width: 0.8mm; Height: 0.7mm; Emitting Color: Blue; Forward Voltage: 3.2V; Viewing Angle: 140°
D6 D9 = 150060YS75000: WL-SMCW Mono-color Chip LED Waterclear, size 0603, Yellow, 2V, 140°; Manufacturer: Wurth Elektronik; Case/Size Code: 0603; Chip Technology: AlInGaP; Dominant Wavelength: 590nm; Luminous Intensity: 120mcd; Peak Wavelength: 595nm; Manufacturer Part Number: 150060YS75000; Category: Signal LEDs; Match Code: WL-SMCW; ComponentLink1Description: Website Link; ComponentLink1URL: https://www.we-online.com/redexpert/article/150060YS75000?ad; ComponentLink2Description: Datasheet Link; ComponentLink2URL: https://www.we-online.com/redexpert/spec/150060YS75000?ad; Mount: Surface Mount; Operating Temperature Max: 85°C; Operating Temperature Min: -40°C; Packaging: Tape and Reel; Length: 1.6mm; Width: 0.8mm; Height: 0.7mm; Emitting Color: Yellow; Forward Voltage: 2V; Viewing Angle: 140°
D7 = 150060RS75000: WL-SMCW Mono-color Chip LED Waterclear, size 0603, Red, 2V, 140°; Manufacturer: Wurth Elektronik; Case/Size Code: 0603; Chip Technology: AlInGaP; Dominant Wavelength: 625nm; Luminous Intensity: 250mcd; Peak Wavelength: 630nm; Manufacturer Part Number: 150060RS75000; Category: Signal LEDs; Match Code: WL-SMCW; ComponentLink1Description: Website Link; ComponentLink1URL: https://www.we-online.com/redexpert/article/150060RS75000?ad; ComponentLink2Description: Datasheet Link; ComponentLink2URL: https://www.we-online.com/redexpert/spec/150060RS75000?ad; Mount: Surface Mount; Operating Temperature Max: 85°C; Operating Temperature Min: -40°C; Packaging: Tape and Reel; Length: 1.6mm; Width: 0.8mm; Height: 0.7mm; Emitting Color: Red; Forward Voltage: 2V; Viewing Angle: 140°
D8 = 150060AS75000: WL-SMCW Mono-color Chip LED Waterclear, size 0603, Amber, 2V, 140°; Manufacturer: Wurth Elektronik; Case/Size Code: 0603; Chip Technology: AlInGaP; Dominant Wavelength: 605nm; Luminous Intensity: 130mcd; Peak Wavelength: 610nm; Manufacturer Part Number: 150060AS75000; Category: Signal LEDs; Match Code: WL-SMCW; ComponentLink1Description: Website Link; ComponentLink1URL: https://www.we-online.com/redexpert/article/150060AS75000?ad; ComponentLink2Description: Datasheet Link; ComponentLink2URL: https://www.we-online.com/redexpert/spec/150060AS75000?ad; Mount: Surface Mount; Operating Temperature Max: 85°C; Operating Temperature Min: -40°C; Packaging: Tape and Reel; Length: 1.6mm; Width: 0.8mm; Height: 0.7mm; Emitting Color: Amber; Forward Voltage: 2V; Viewing Angle: 140°
R14-R19 = Resistor 0402 1K
  R14: Value: 15K
  R15: Value: 8K2
  R16: Value: 3K3
  R17: Value: 1K
  R18 R19: Value: 470R

## Sheet OSD.SchDoc
size A4; SheetNumber: 8; SheetTotal: 13
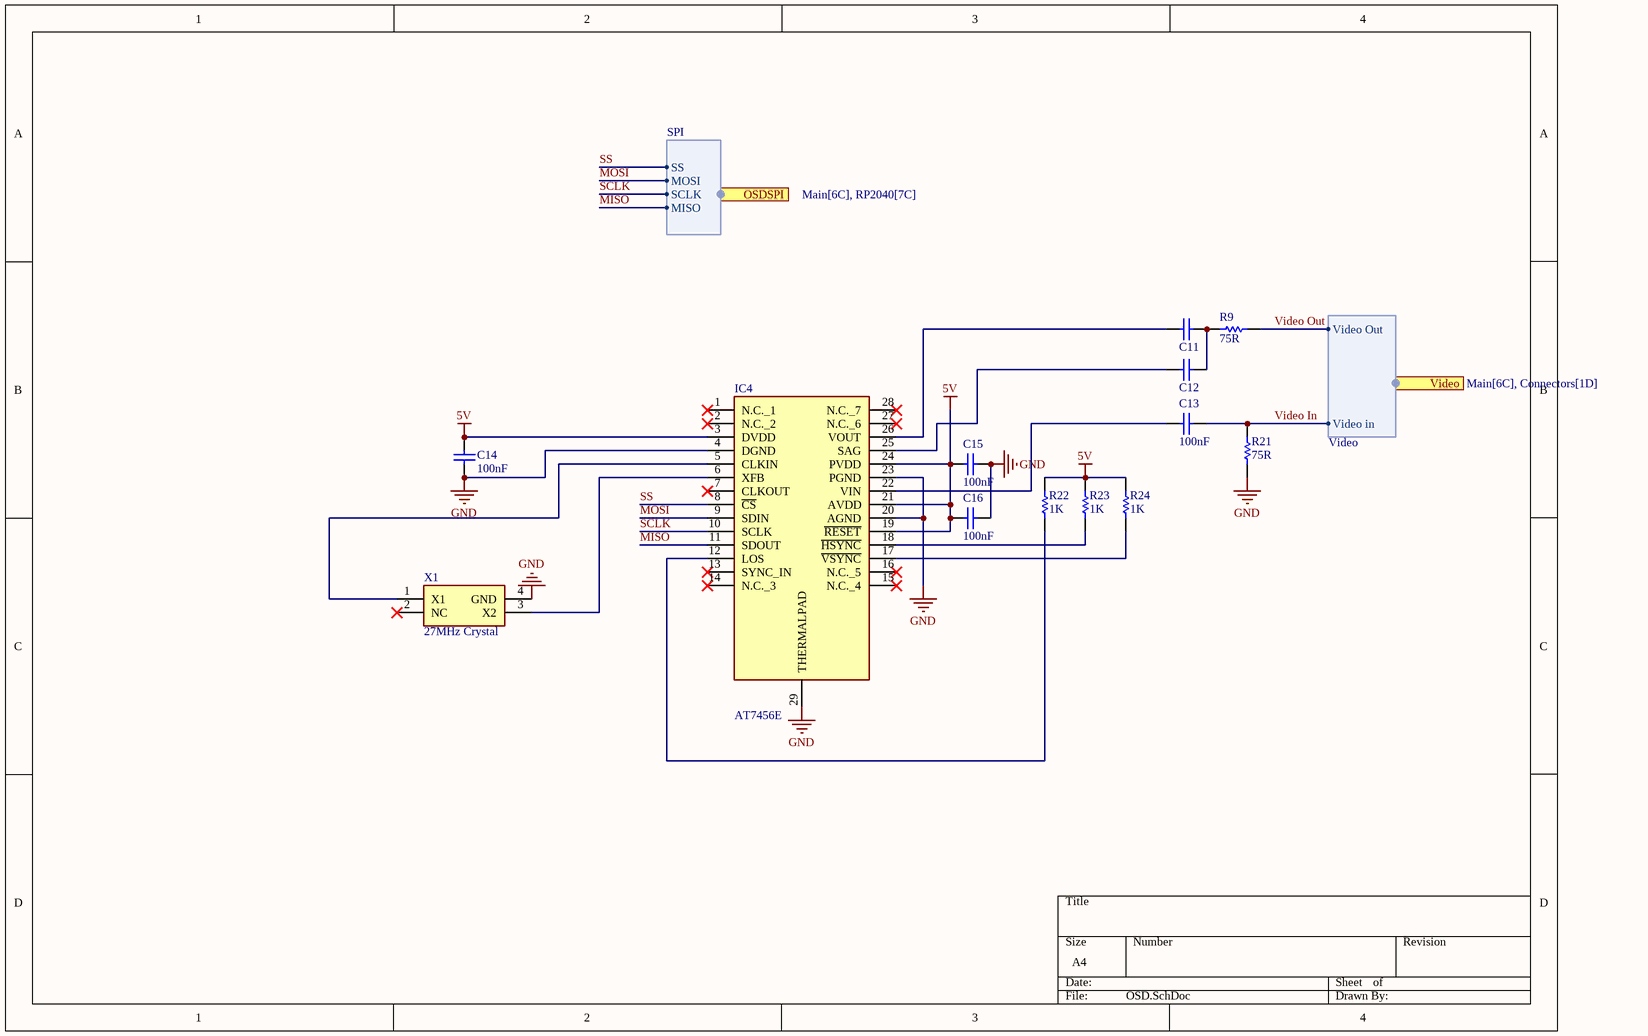
[diagram p6: OSD.SchDoc]

### Parts
C11  10µF  [WCAP-CSGP_0603_L1.6W0.8H0.8_Reflow]  (value not drawn)
C12  10µF  [WCAP-CSGP_0603_L1.6W0.8H0.8_Reflow]  (value not drawn)
C13  100nF  [0402 cap]
C14  100nF  [0402 cap]
C15  100nF  [0402 cap]
C16  100nF  [0402 cap]
IC4  AT7456E  [SOP65P640X120-29N]
R9  75R  [0402 resistor]
R21  75R  [0402 resistor]
R22  1K  [0402 resistor]
R23  1K  [0402 resistor]
R24  1K  [0402 resistor]
X1  27MHz Crystal  [1612 crystal]

### Ports
OSDSPI (harness SPI, see Main[6C], RP2040[7C]), Video (harness Video, see Main[6C], Connectors[1D])

### Harnesses
SPI: SS, MOSI, SCLK, MISO
Video: Video Out, Video in

### Nets
5V: C14.2 C15.1 C16.1 IC4.3(DVDD) IC4.19(~{RESET}) IC4.21(AVDD) IC4.24(PVDD) R22.2 R23.2 R24.2
GND: C14.1 C15.2 C16.2 IC4.4(DGND) IC4.20(AGND) IC4.23(PGND) IC4.29(THERMALPAD) R21.2 X1.4(GND)
MISO: IC4.11(SDOUT) ; port OSDSPI.MISO
MOSI: IC4.9(SDIN) ; port OSDSPI.MOSI
SCLK: IC4.10(SCLK) ; port OSDSPI.SCLK
SS: IC4.8(~{CS}) ; port OSDSPI.SS  [project net OSD_SS]
Video In: C13.2 R21.1 ; port Video.Video in
Video Out: R9.1 ; port Video.Video Out
NetC11_1: C11.1 IC4.26(VOUT)
NetC11_2: C11.2 C12.2 R9.2
NetC12_1: C12.1 IC4.25(SAG)
NetC13_1: C13.1 IC4.22(VIN)
NetIC4_5: IC4.5(CLKIN) X1.1(X1)
NetIC4_6: IC4.6(XFB) X1.3(X2)
NetIC4_12: IC4.12(LOS) R22.1
NetIC4_17: IC4.17(~{VSYNC}) R24.1
NetIC4_18: IC4.18(~{HSYNC}) R23.1

Not connected (* = marked no-connect by the designer): IC4 1(N.C._1)* 2(N.C._2)* 7(CLKOUT)* 13(SYNC_IN)* 14(N.C._3)* 15(N.C._4)* 16(N.C._5)* 27(N.C._6)* 28(N.C._7)*; X1 2(NC)*

### Library data of the parts
C11 C12 = 885012106031: WCAP-CSGP Multilayer Ceramic Chip Capacitor, General Purpose, size 0603, X5R, 10µF, 25VDC; Manufacturer: Wurth Elektronik; Case/Size Code: 0603; Capacitance Tolerance: +/20%; Dissipation Factor: 20%; Insulation Resistance: 0.01GΩ; Rated Voltage (DC): 25V; Technical Reference: X5R0603106M025DFCT10000; ComponentLink1Description: Website Link; ComponentLink1URL: https://www.we-online.com/redexpert/article/885012106031?ad; ComponentLink2Description: Datasheet Link; ComponentLink2URL: https://www.we-online.com/redexpert/spec/885012106031?ad; Manufacturer Part Number: 885012106031; Category: Multilayer Ceramic Chip Capacitors; Match Code: WCAP-CSGP; Mount: Surface Mount; Operating Temperature Max: 85°C; Operating Temperature Min: -55°C; Packaging: Tape and Reel; Length: 1.6mm; Width: 0.8mm; Height: 0.8mm; Capacitance: 10µF; Ceramic Type: X5R
C13-C16 = Capacitor 0402 100nF: Value: 100nF
IC4 = AT7456E: Integrated Circuit; Manufacturer_Name: ICOF; Datasheet Link: https://datasheet.lcsc.com/szlcsc/ZHONGKEWEI-AT7456E_C82351.pdf; Height: 1.2mm; Manufacturer_Part_Number: AT7456E
R9 R21-R24 = Resistor 0402 1K
  R9 R21: Value: 75R
  R22-R24: Value: 1K
X1 = 1612 Crystal: HD 7E027000H01; Manufacturer_Name: Microchip; Manufacturer_Part_Number: DSC6003MA3B-032K768; Datasheet Link: https://www.mouser.es/datasheet/2/268/DSC60xxB-Ultra-Small-Ultra-Low-Power-MEMS-Oscillat-1660527.pdf; Height: 0.89mm; Mouser Part Number: 579-6003MA3B032K768; Mouser Price/Stock: https://www.mouser.co.uk/ProductDetail/Microchip-Technology/DSC6003MA3B-032K768?qs=PqoDHHvF64%252BWTEYTiC%2Fvdw%3D%3D

## Sheet Baro.SchDoc
size A4; SheetNumber: 8; SheetTotal: 11
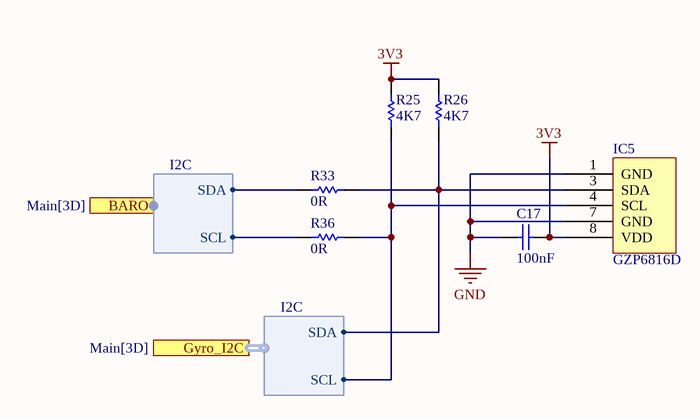
[diagram p7: Baro.SchDoc]

### Parts
(Parts that share a designator on the sheet are numbered #1, #2 ... from top to bottom, then left to right.)
C17  100nF  [0402 cap]
IC5#1  GZP6816D  [GZP6816D]
R25  4K7  [0402 resistor]
R26  4K7  [0402 resistor]
R33  0R  [RESC1005X40X25NL05T10]
R36  0R  [RESC1005X40X25NL05T10]

### Ports
BARO (harness I2C, see Main[3D]), Gyro_I2C (harness I2C, see Main[3D])

### Harnesses
I2C: SDA, SCL

### Nets
3V3: C17.2 IC5#1.8(VDD) R25.2 R26.2
GND: C17.1 IC5#1.1(GND) IC5#1.7(GND)
NetIC5#1_3: IC5#1.3(SDA) R26.1 R33.2 ; port Gyro_I2C.SDA
NetIC5#1_4: IC5#1.4(SCL) R25.1 R36.2 ; port Gyro_I2C.SCL
NetR33_1: R33.1 ; port BARO.SDA
NetR36_1: R36.1 ; port BARO.SCL

### Library data of the parts
C17 = Capacitor 0402 100nF: Value: 100nF
R25 R26 = Resistor 0402 1K: Value: 4K7
R33 R36 = CMP-1011-00001-2: Manufacturer: Yageo / Phycomp; Part Number: RC0402JR-070RL

## Sheet Gyro.SchDoc
size A4; SheetNumber: 6; SheetTotal: 13
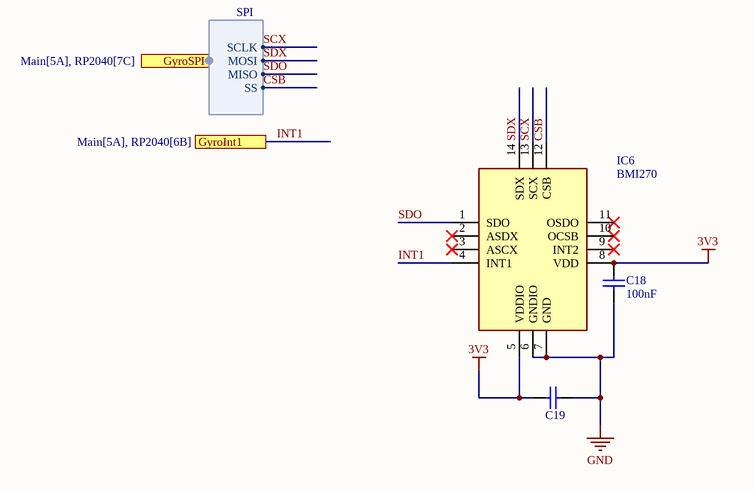
[diagram p8: Gyro.SchDoc]

### Parts
C18  100nF  [0402 cap]
C19  100nF  [WCAP-CSGP_0603_L1.6W0.8H0.8_Reflow]  (value not drawn)
IC6  BMI270  [QFN50P300X250X87-14N]

### Ports
GyroInt1 (see Main[5A], RP2040[6B]), GyroSPI (harness SPI, see Main[5A], RP2040[7C])

### Harnesses
SPI: SS, MISO, MOSI, SCLK

### Nets
3V3: C18.2 C19.2 IC6.5(VDDIO) IC6.8(VDD)
GND: C18.1 C19.1 IC6.6(GNDIO) IC6.7(GND)
CSB: IC6.12(CSB) ; port GyroSPI.SS
INT1: IC6.4(INT1) ; port GyroInt1  [project net Gyro_Int1]
SCX: IC6.13(SCX) ; port GyroSPI.SCLK  [project net SCLK]
SDO: IC6.1(SDO) ; port GyroSPI.MISO  [project net MISO]
SDX: IC6.14(SDX) ; port GyroSPI.MOSI  [project net MOSI]

Not connected (* = marked no-connect by the designer): IC6 2(ASDX)* 3(ASCX)* 9(INT2)* 10(OCSB)* 11(OSDO)*

### Library data of the parts
C18 = Capacitor 0402 100nF: Value: 100nF
C19 = 885012206095: as C28 on sheet RP2040; Manufacturer Part Number: 885012206095; Category: Multilayer Ceramic Chip Capacitors; Match Code: WCAP-CSGP; ComponentLink1Description: Website Link; ComponentLink1URL: https://www.we-online.com/redexpert/article/885012206095?ad; ComponentLink2Description: Datasheet Link; ComponentLink2URL: https://www.we-online.com/redexpert/spec/885012206095?ad; Mount: Surface Mount; Operating Temperature Max: 125°C; Operating Temperature Min: -55°C; Packaging: Tape and Reel; Length: 1.6mm; Width: 0.8mm; Height: 0.8mm; Capacitance: 100nF; Ceramic Type: X7R
IC6 = BMI270: Integrated Circuit; Manufacturer_Name: BOSCH; Datasheet Link: https://www.mouser.de/datasheet/2/783/BST-BMI270-FL000-1530947.pdf; Height: 0.87mm; Manufacturer_Part_Number: BMI270; Mouser Part Number: 262-BMI270; Mouser Price/Stock: https://www.mouser.co.uk/ProductDetail/Bosch-Sensortec/BMI270?qs=u16ybLDytRYIj%252BjQEee88A%3D%3D; Arrow Part Number: BMI270; Arrow Price/Stock: https://www.arrow.com/en/products/bmi270/bosch?region=nac

## Sheet Connectors.SchDoc
size A4; SheetNumber: 3; SheetTotal: 11
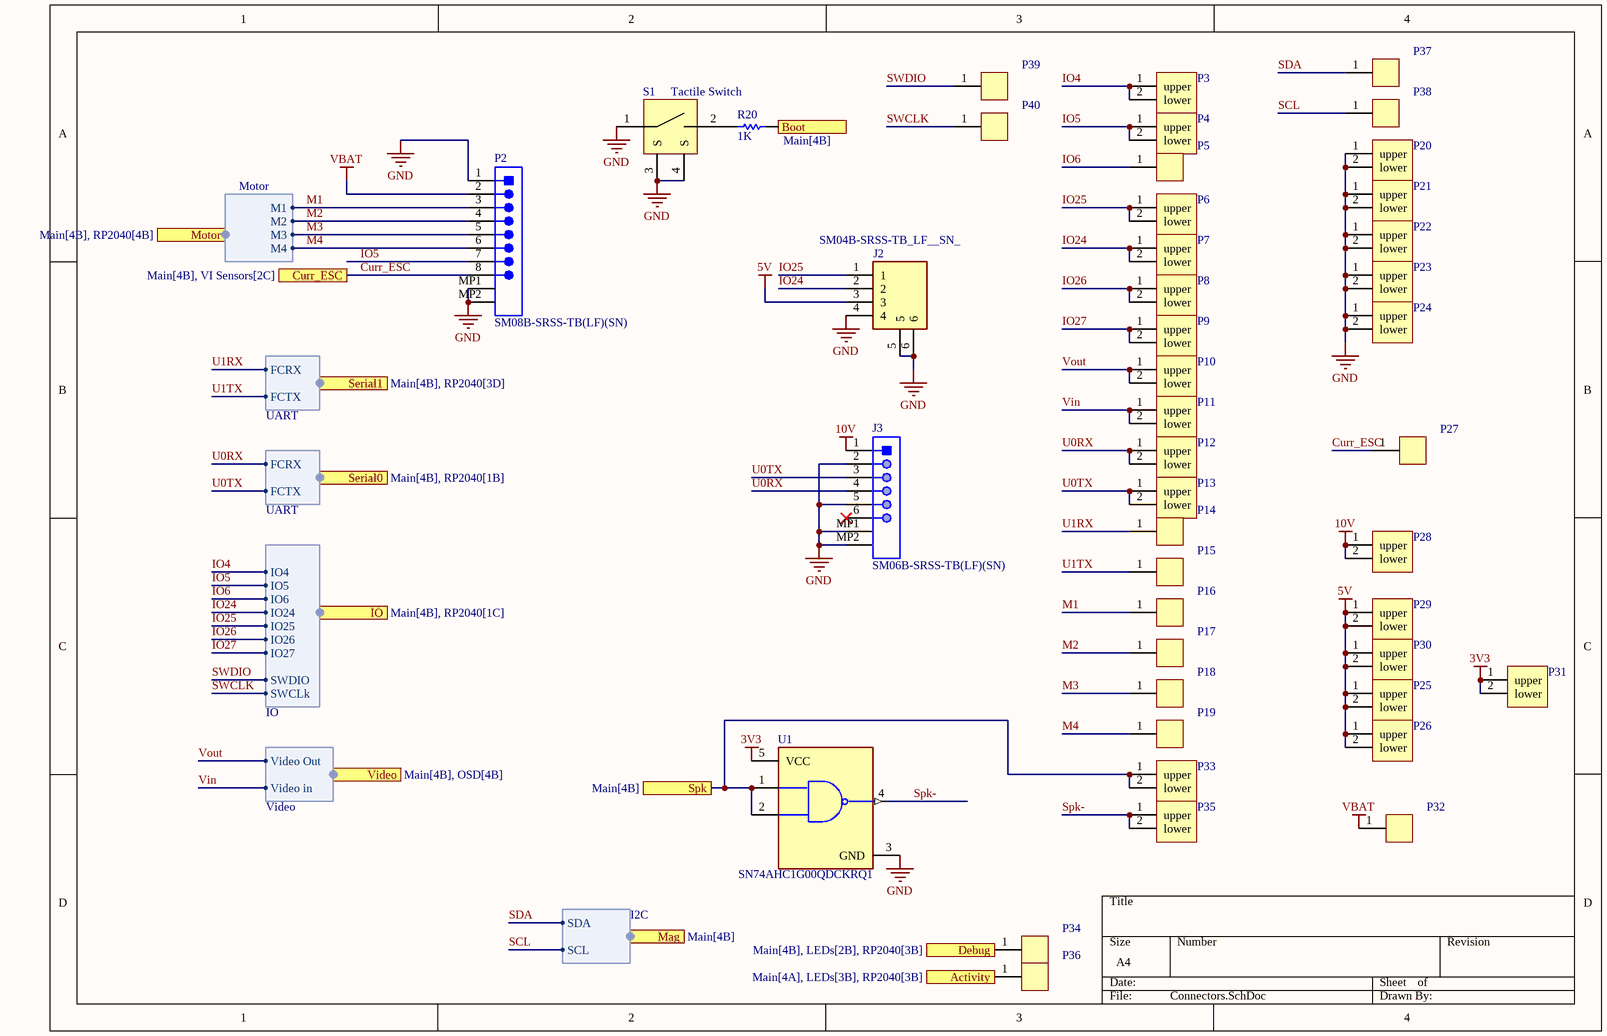
[diagram p9: Connectors.SchDoc]

### Parts
J2  SM04B-SRSS-TB_LF__SN_  [SM04B-SRSS-TB(LFSN)]
J3  SM06B-SRSS-TB(LF)(SN)  [JST-SM06B-SRSS-TB_V]
P2  SM08B-SRSS-TB(LF)(SN)  [JST-SM08B-SRSS-TB_V]
P3  solder pad rounded double sided  [solder pad double sided rounded - duplicate]  (value not drawn)
P4  solder pad rounded double sided  [solder pad double sided rounded - duplicate]  (value not drawn)
P5  solder pad rounded single sided  [solder pad single sided rounded]  (value not drawn)
P6  solder pad rounded double sided  [solder pad double sided rounded - duplicate]  (value not drawn)
P7  solder pad rounded double sided  [solder pad double sided rounded - duplicate]  (value not drawn)
P8  solder pad rounded double sided  [solder pad double sided rounded - duplicate]  (value not drawn)
P9  solder pad rounded double sided  [solder pad double sided rounded - duplicate]  (value not drawn)
P10  solder pad rounded double sided  [solder pad double sided rounded - duplicate]  (value not drawn)
P11  solder pad rounded double sided  [solder pad double sided rounded - duplicate]  (value not drawn)
P12  solder pad rounded double sided  [solder pad double sided rounded - duplicate]  (value not drawn)
P13  solder pad rounded double sided  [solder pad double sided rounded - duplicate]  (value not drawn)
P14  solder pad rounded single sided  [solder pad single sided rounded]  (value not drawn)
P15  solder pad rounded single sided  [solder pad single sided rounded]  (value not drawn)
P16  solder pad rounded single sided  [solder pad single sided rounded]  (value not drawn)
P17  solder pad rounded single sided  [solder pad single sided rounded]  (value not drawn)
P18  solder pad rounded single sided  [solder pad single sided rounded]  (value not drawn)
P19  solder pad rounded single sided  [solder pad single sided rounded]  (value not drawn)
P20  solder pad square double sided  [solder pad double sided square]  (value not drawn)
P21  solder pad square double sided  [solder pad double sided square]  (value not drawn)
P22  solder pad square double sided  [solder pad double sided square]  (value not drawn)
P23  solder pad square double sided  [solder pad double sided square]  (value not drawn)
P24  solder pad square double sided  [solder pad double sided square]  (value not drawn)
P25  solder pad chamfered double sided  [solder pad double sided chamfered]  (value not drawn)
P26  solder pad chamfered double sided  [solder pad double sided chamfered]  (value not drawn)
P27  solder pad rounded single sided  [solder pad single sided rounded]  (value not drawn)
P28  solder pad chamfered double sided  [solder pad double sided chamfered]  (value not drawn)
P29  solder pad chamfered double sided  [solder pad double sided chamfered]  (value not drawn)
P30  solder pad chamfered double sided  [solder pad double sided chamfered]  (value not drawn)
P31  solder pad chamfered double sided  [solder pad double sided chamfered]  (value not drawn)
P32  solder pad chamfered single sided  [solder pad single sided chamfered]  (value not drawn)
P33  solder pad rounded double sided  [solder pad double sided rounded - duplicate]  (value not drawn)
P34  solder pad rounded single sided  [solder pad single sided rounded]  (value not drawn)
P35  solder pad rounded double sided  [solder pad double sided rounded - duplicate]  (value not drawn)
P36  solder pad rounded single sided  [solder pad single sided rounded]  (value not drawn)
P37  solder pad rounded single sided  [solder pad single sided rounded]  (value not drawn)
P38  solder pad rounded single sided  [solder pad single sided rounded]  (value not drawn)
P39  solder pad rounded single sided  [solder pad single sided rounded]  (value not drawn)
P40  solder pad rounded single sided  [solder pad single sided rounded]  (value not drawn)
R20  1K  [0402 resistor]
S1  Tactile Switch  [Tactile Switch]
U1  SN74AHC1G00QDCKRQ1  [FP-DCK0005A-IPC_A]

### Ports
Activity (see Main[4A], LEDs[3B], RP2040[3B]), Boot (see Main[4B]), Curr_ESC (see Main[4B], VI Sensors[2C]), Debug (see Main[4B], LEDs[2B], RP2040[3B]), IO (harness IO, see Main[4B], RP2040[1C]), Mag (harness I2C, see Main[4B]), Motor (harness Motor, see Main[4B], RP2040[4B]), Serial0 (harness UART, see Main[4B], RP2040[1B]), Serial1 (harness UART, see Main[4B], RP2040[3D]), Spk (see Main[4B]), Video (harness Video, see Main[4B], OSD[4B])

### Harnesses
Motor: M1, M2, M3, M4
UART: FCRX, FCTX
IO: IO4, IO5, IO6, IO24, IO25, IO26, IO27, SWDIO, SWCLk
Video: Video Out, Video in
I2C: SDA, SCL

### Nets
3V3: P31.1(upper) P31.2(lower) U1.5(VCC)
5V: J2.3 P25.1(upper) P25.2(lower) P26.1(upper) P26.2(lower) P29.1(upper) P29.2(lower) P30.1(upper) P30.2(lower)
10V: J3.1 P28.1(upper) P28.2(lower)
GND: J2.4 J2.5 J2.6 J3.2 J3.5 J3.MP1 J3.MP2 P2.1 P2.MP1 P2.MP2 P20.1(upper) P20.2(lower) P21.1(upper) P21.2(lower) P22.1(upper) P22.2(lower) P23.1(upper) P23.2(lower) P24.1(upper) P24.2(lower) S1.1 S1.3(S) S1.4(S) U1.3(GND)
VBAT: P2.2 P32.1(upper)
Activity: P36.1(upper) ; port Activity
Curr_ESC: P2.8 P27.1(upper) ; port Curr_ESC
Debug: P34.1(upper) ; port Debug
IO4: P3.1(upper) P3.2(lower) ; port IO.IO4
IO5: P2.7 P4.1(upper) P4.2(lower) ; port IO.IO5
IO6: P5.1(upper) ; port IO.IO6
IO24: J2.2 P7.1(upper) P7.2(lower) ; port IO.IO24
IO25: J2.1 P6.1(upper) P6.2(lower) ; port IO.IO25
IO26: P8.1(upper) P8.2(lower) ; port IO.IO26
IO27: P9.1(upper) P9.2(lower) ; port IO.IO27
M1: P2.3 P16.1(upper) ; port Motor.M1
M2: P2.4 P17.1(upper) ; port Motor.M2
M3: P2.5 P18.1(upper) ; port Motor.M3
M4: P2.6 P19.1(upper) ; port Motor.M4
SCL: P38.1(upper) ; port Mag.SCL
SDA: P37.1(upper) ; port Mag.SDA
Spk+: P33.1(upper) P33.2(lower) U1.1(A) U1.2(B) ; port Spk
Spk-: P35.1(upper) P35.2(lower) U1.4(Y)
SWCLK: P40.1(upper) ; port IO.SWCLk
SWDIO: P39.1(upper) ; port IO.SWDIO
U0RX: J3.4 P12.1(upper) P12.2(lower) ; port Serial0.FCRX  [project net ESPTX]
U0TX: J3.3 P13.1(upper) P13.2(lower) ; port Serial0.FCTX  [project net ESPRX]
U1RX: P14.1(upper) ; port Serial1.FCRX
U1TX: P15.1(upper) ; port Serial1.FCTX
Vin: P11.1(upper) P11.2(lower) ; port Video.Video in  [project net Video In]
Vout: P10.1(upper) P10.2(lower) ; port Video.Video Out  [project net Video Out]
NetIC1_56: R20.2 ; port Boot
NetR20_1: R20.1 S1.2

Not connected (* = marked no-connect by the designer): J3 6*

### Library data of the parts
J2 = SM04B-SRSS-TB_LF__SN_: Connector; Manufacturer_Name: JST (JAPAN SOLDERLESS TERMINALS); Manufacturer_Part_Number: SM04B-SRSS-TB(LF)(SN); Datasheet Link: http://www.jst-mfg.com/product/pdf/eng/eSH.pdf; Arrow Part Number: SM04B-SRSS-TB(LF)(SN); Arrow Price/Stock: https://www.arrow.com/en/products/sm04b-srss-tb-lf-sn/jst-manufacturing?region=europe
J3 = CMP-2000-07080-1: Male Header, Pitch 1 mm, 1 x 6 Position, Height 2.95 mm, -25 to 85 degC, RoHS, Tape and Reel; Manufacturer: JST; No of Positions: 6; Pitch: 1mm; Style/Orientation: RightAngleHeader/Plug; Datasheet URL: https://datasheet.ciiva.com/26894/getdatasheetpartid-708885-26894671.pdf; Package Description: Male Header, Pitch 1 mm, 1 X 6 Position, Height 2.9 mm; Termination: Solder; Manufacturer URL: http://www.jst.com/home2.html; Type: ShroudedHeader; Package Reference: SM06B-SRSS-TB; Datasheet Version: 11/2010; Mounting Technology: SurfaceMount
P2 = CMP-2000-07082-1: Male Header, Pitch 1 mm, 1 x 8 Position, Height 2.95 mm, -25 to 85 degC, RoHS, Tape and Reel; Manufacturer: JST; Style/Orientation: RightAngleHeader/Plug; Pitch: 1mm; No of Positions: 8; Manufacturer URL: http://www.jst.com/home2.html; Mounting Technology: SurfaceMount; Package Description: Male Header, Pitch 1 mm, 1 x 8 Position, Height 2.95 mm; Datasheet URL: http://www.jst-mfg.com/product/pdf/eng/eSR.pdf; Type: ShroudedHeader; Termination: Crimp; Package Reference: SM08B-SRSS-TB; Datasheet Version: 11/2010
R20 = Resistor 0402 1K: Value: 1K
U1 = CMP-0859-00415-4: IC GATE NAND 1CH 2-INP SC70-5; Number of Output Lines: 1; Max Supply Voltage: 5.5V; High Level Output Current: -8mA; Propagation Delay: 7.5ns; Min Supply Voltage: 2V; Logic Function: NAND GATE; Low Level Output Current: 8mA; Number of Inputs: 2; Quiescent Current: 1uA; Lead Free: Lead Free; Series: 74AHC; Number of Pins: 5; Number of Gates: 1; Max Operating Temperature: 125°C; Number of Elements: 1; Case/Package: SC; Packaging: Tape and Reel; Technology: CMOS; Radiation Hardening: No; Min Operating Temperature: -40°C; Output Current: 8mA; Mount: Surface Mount; Number of Bits: 1; RoHS Compliant: Yes; Number of Circuits: 1; Number of Input Lines: 2; Package Quantity: 1; Number of Outputs: 1

## Sheet VI Sensors.SchDoc
size A4; SheetNumber: 12; SheetTotal: 13
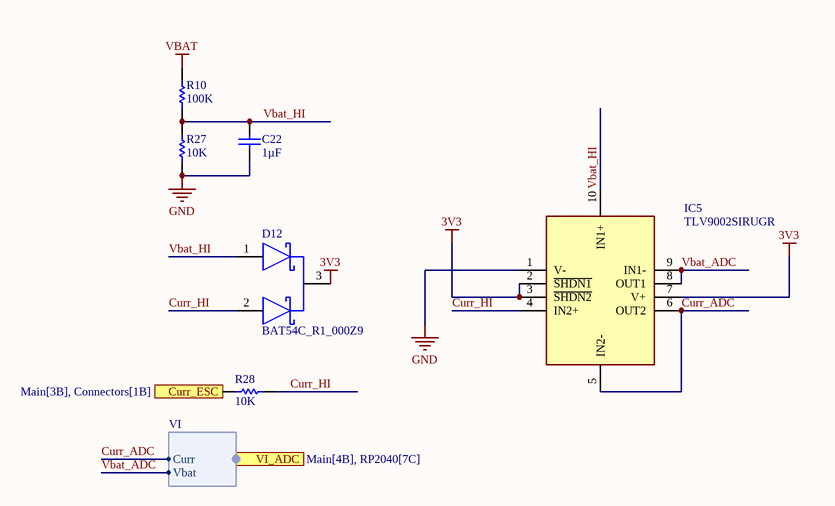
[diagram p10: VI Sensors.SchDoc]

### Parts
(Parts that share a designator on the sheet are numbered #1, #2 ... from top to bottom, then left to right.)
C22  1µF  [0402 cap]
D12  BAT54C_R1_000Z9  [FP-SOT23-MFG]
IC5#2  TLV9002SIRUGR  [QFN50P150X200X40-10N]
R10  100K  [0402 resistor]
R27  10K  [0402 resistor]
R28  10K  [0402 resistor]

### Ports
Curr_ESC (see Main[3B], Connectors[1B]), VI_ADC (harness VI, see Main[4B], RP2040[7C])

### Harnesses
VI: Curr, Vbat

### Nets
3V3: D12.3(COMMON_CATHODE) IC5#2.2(~{SHDN1}) IC5#2.3(~{SHDN2}) IC5#2.7(V+)
GND: C22.1 IC5#2.1(V-) R27.1
VBAT: R10.2
Curr_ADC: IC5#2.5(IN2-) IC5#2.6(OUT2) ; port VI_ADC.Curr
Curr_ESC: R28.2 ; port Curr_ESC
Curr_HI: D12.2(2_ANODE) IC5#2.4(IN2+) R28.1
Vbat_ADC: IC5#2.8(OUT1) IC5#2.9(IN1-) ; port VI_ADC.Vbat
Vbat_HI: C22.2 D12.1(1_ANODE) IC5#2.10(IN1+) R10.1 R27.2

### Library data of the parts
C22 = Capacitor 0402 100nF: Value: 1µF
D12 = CMP-14398-000007-1: DIODE ARRAY SCHOTTKY 30V SOT23; Manufacturer: Nexperia; Manufacturer Part Number: BAT54C,215; Automotive Grade: Grade 0; Peak Reverse Current: 2uA; Forward Current: 200mA; Max Surge Forward Current: 600mA; Value: 10pF; Max Junction Temp: +150°C; Lead Free: Yes; Automotive: Yes; Device Class L1: Discrete Semiconductors; Digikey Description: DIODE ARRAY SCHOTTKY 30V SOT23; Reverse Voltage: 30V; ComponentLink2URL: https://assets.nexperia.com/documents/data-sheet/BAT54_SER.pdf; Device Class L2: Diodes; Category: Diode; Octopart: https://octopart.com/bat54c%2C215-nexperia-78738945; Package: SOT23; Mouser Description: Schottky Diodes, Rectifiers - Arrays SOT-23 (TO-236AB) 30V 200mA (DC) Surface Mount; RoHS: TRUE; Temperature: to +150°C; Ambient Temperature Range Low: -55°C; Height: 1.1mm; Device Class L3: Schottky Diodes; Temperature Range High: +150°C; Footprint Url: https://assets.nexperia.com/documents/outline-drawing/SOT23.pdf; Capacitance: 10pF; Ambient Temperature Range High: +150°C; Ipc Land Pattern Name: SOT95P230X100-3; ComponentLink2Description: Datasheet
IC5#2 = TLV9002SIRUGR: Integrated Circuit; Manufacturer_Name: Texas Instruments; Datasheet Link: http://www.ti.com/lit/gpn/TLV9002; Height: 0.4mm; Manufacturer_Part_Number: TLV9002SIRUGR; Mouser Part Number: 595-TLV9002SIRUGR; Mouser Price/Stock: https://www.mouser.co.uk/ProductDetail/Texas-Instruments/TLV9002SIRUGR?qs=2WXlatMagcFgZnU86g5SIg%3D%3D; Arrow Part Number: TLV9002SIRUGR; Arrow Price/Stock: https://www.arrow.com/en/products/tlv9002sirugr/texas-instruments?region=nac
R10 R27 R28 = Resistor 0402 1K
  R10: Value: 100K
  R27 R28: Value: 10K